# Altium project PB-RESPIRADOR-01.PrjPcb
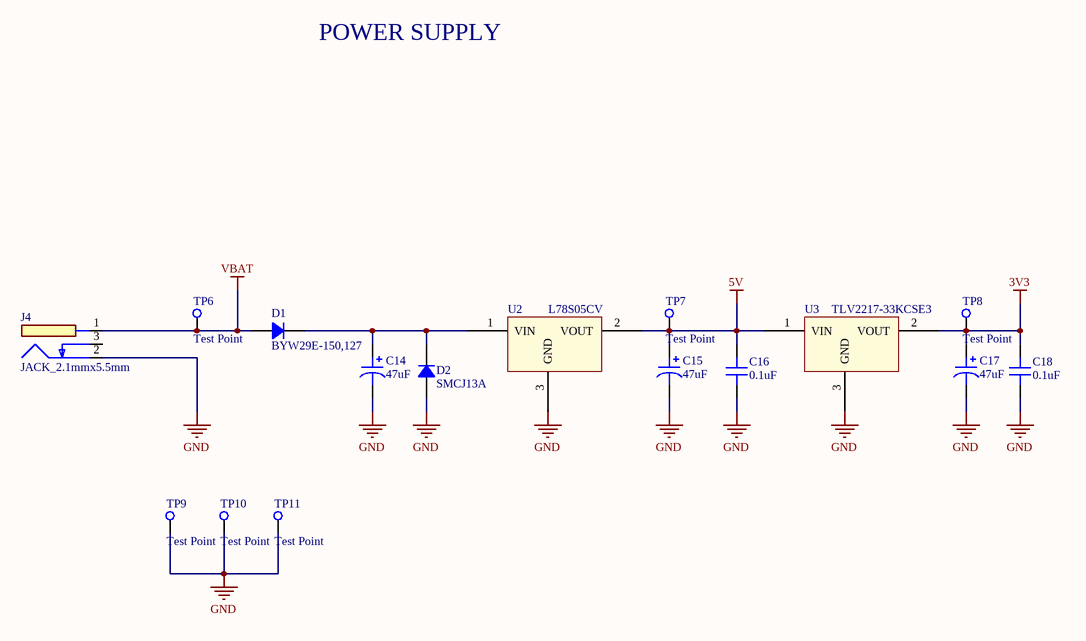
[diagram p0: POWER.SchDoc]
5 sheets, 133 parts. Net scope: hierarchical (ports join the sheet entries above them; power ports are global).
Sheets:
  POWER.SchDoc
  MAIN.SchDoc
    MCU = MCU.SchDoc
    SWITCHING = SWITCHING.SchDoc
    SENSORS = SENSORS.SchDoc

## Sheet POWER.SchDoc
size A4

### Parts
C14  47uF  [CAP_POL_D6.3MM_L5.8MM_H6.6MM]
C15  47uF  [CAP_POL_D6.3MM_L5.8MM_H6.6MM]
C16  0.1uF  [C_0805]
C17  47uF  [CAP_POL_D6.3MM_L5.8MM_H6.6MM]
C18  0.1uF  [C_0805]
D1  BYW29E-150,127  [TO-220-2]
D2  SMCJ13A  [DO-214AB-2]
J4  JACK_2.1mmx5.5mm  [JACK_2.1mmx5.5mm]
TP6  Test Point  [Test_Point]
TP7  Test Point  [Test_Point]
TP8  Test Point  [Test_Point]
TP9  Test Point  [Test_Point]
TP10  Test Point  [Test_Point]
TP11  Test Point  [Test_Point]
U2  L78S05CV  [TO-220]
U3  TLV2217-33KCSE3  [TO-220]

### Nets
3V3: C17.1 C18.2 TP8.1(TP) U3.2(VOUT)  [project net LM9402VDD]
5V: C15.1 C16.2 TP7.1(TP) U2.2(VOUT) U3.1(VIN)
GND: C14.2 C15.2 C16.1 C17.2 C18.1 D2.1 J4.2 TP9.1(TP) TP10.1(TP) TP11.1(TP) U2.3(GND) U3.3(GND)
VBAT: D1.1 J4.1 TP6.1(TP)
NetC14_1: C14.1 D1.2 D2.2 U2.1(VIN)

Not connected (* = marked no-connect by the designer): J4 3

### Notes on the sheet
- POWER SUPPLY

### Library data of the parts
C14 C15 C17 = C_POL_UWT1V470MCL1GS: CAP 47UF 35V ELECT WT SMD D6.3MM L5.8MM H 6.6MM; Part Number: UWT1V470MCL1GS; Datasheet: https://br.mouser.com/datasheet/2/293/e-wt-30307.pdf; Supplier: https://br.mouser.com/ProductDetail/Nichicon/UWT1V470MCL1GS?qs=ljCeji4nMDl8Y30ehuNAUQ%3D%3D; Value: 47uF; Voltage: 35V
C16 C18 = C_0805_GRM21BR71H104KA01L: CAP CER .1UF 50V 10% X7R 080; Part Number: GRM21BR71H104KA01L; Datasheet: https://br.mouser.com/datasheet/2/281/murata_03052018_GRM_Series_1-1310166.pdf; Supplier: https://br.mouser.com/ProductDetail/Murata-Electronics/GRM21BR71H104KA01L?qs=JovLnzPPZAL81o2XNDa%2FDA%3D%3D; Value: 0.1uF; Voltage: 50V
D1 = DIODE_BYW29E-150,127: DIODE RECT UFAST 150V TO220AC SOD59; Part Number: BYW29E-150,127; Supplier: https://br.mouser.com/ProductDetail/WeEn-Semiconductors/BYW29E-150127?qs=me8TqzrmIYVz9CWyXJlNFA%3D%3D; Datasheet: https://br.mouser.com/datasheet/2/848/byw29e-150-1520821.pdf; Voltage: 150V; Power: *
D2 = DIODE_SMCJ13A: DIODE TVS 13V 1500W UNI 5% SMC DO-214AB-2_; Voltage: 150V; Part Number: SMCJ13A; Supplier: https://br.mouser.com/ProductDetail/Littelfuse/SMCJ13A?qs=JJML70Qc14udM04Txwcydg%3D%3D; Datasheet: https://br.mouser.com/datasheet/2/848/byw29e-150-1520821.pdf; Power: 1500W
J4 = JACK_2.1mmx5.5mm: Jack/Connector 2.1mm x 5.5mm; Part Number: CON-SOCJ-2155; Manufacturer: Gravitech; Datasheet: http://www.gravitech.us/poja2x51.html; Supplier: https://br.mouser.com/ProductDetail/Gravitech/CON-SOCJ-2155?qs=sGAEpiMZZMvtrnhC60i%252BOueHg%2FyK0jmoLPszqcLww24%3D
U2 = REGULATOR_L78S05CV: IC REG POSITIVE 2A 5V TO-220; Part Number: L78S05CV; Datasheet: https://br.mouser.com/datasheet/2/389/l78s-974158.pdf; Supplier: https://br.mouser.com/ProductDetail/STMicroelectronics/L78S05CV-DG?qs=UOUhb9503hFQHy635AeyYA%3D%3D
U3 = REGULATOR_TLV2217: IC LDO REG FXDVOLT 3.3V TO-220; Part Number: TLV2217-33KCSE3; Datasheet: http://www.ti.com/general/docs/suppproductinfo.tsp?distId=26&gotoUrl=http%3A%2F%2Fwww.ti.com%2Flit%2Fgpn%2Ftlv2217; Supplier: https://br.mouser.com/ProductDetail/Texas-Instruments/TLV2217-33KCSE3?qs=LVErsypW30y56XyeRJBjlA%3D%3D

## Sheet MAIN.SchDoc
size A4
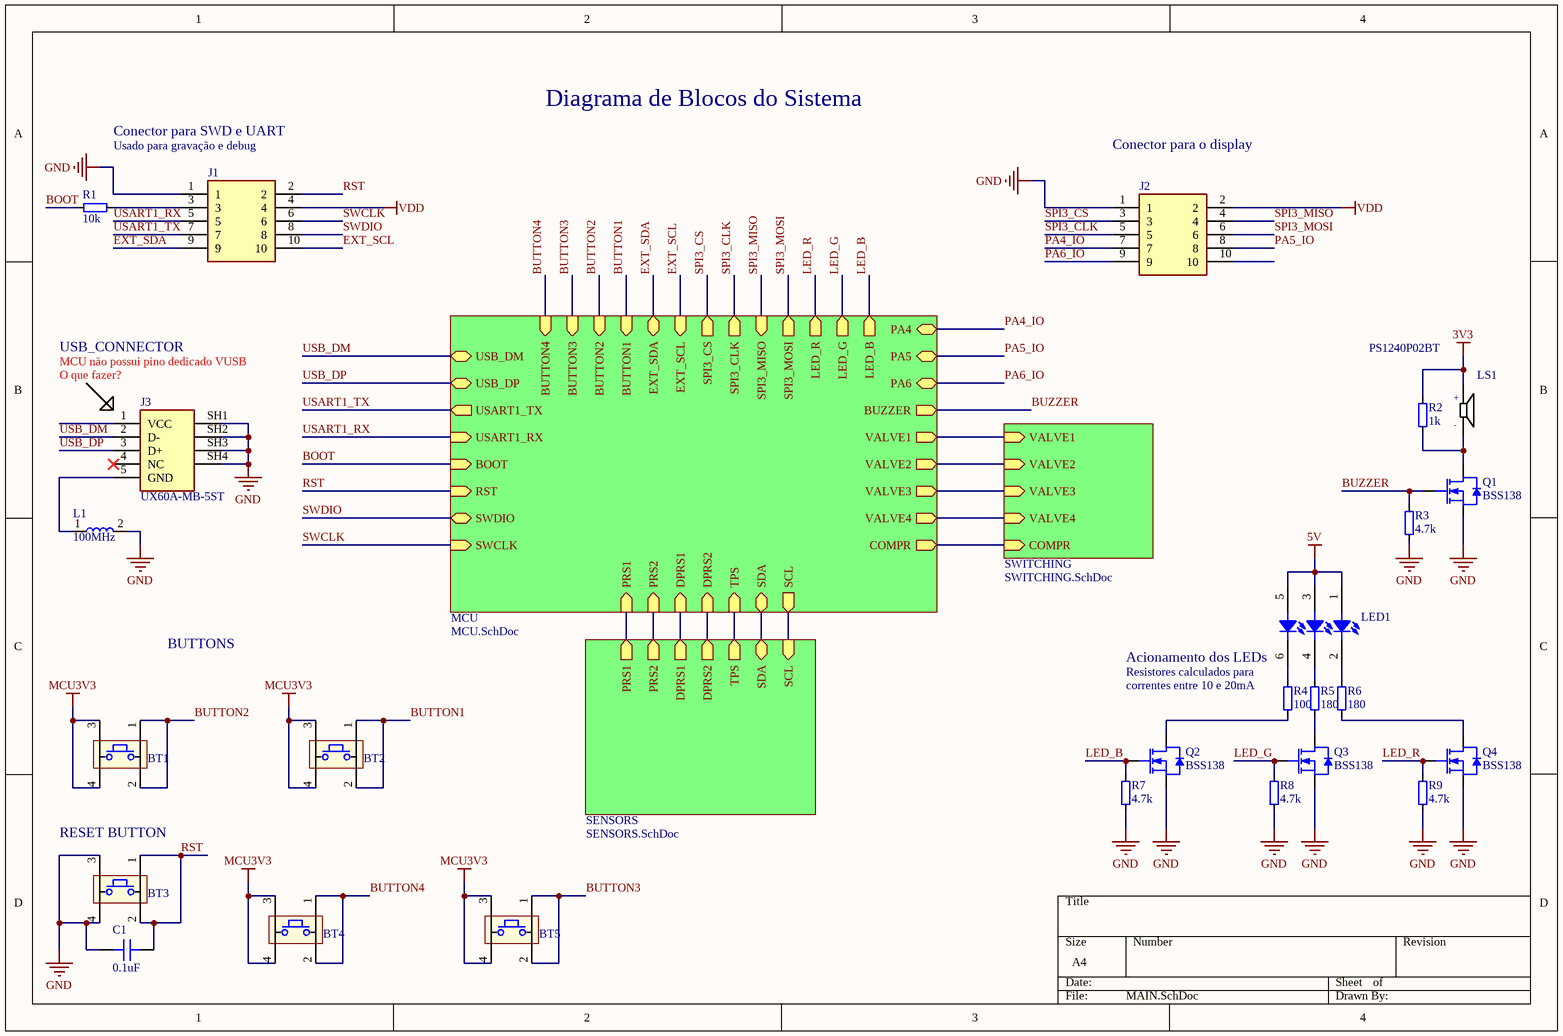
[diagram p1: MAIN.SchDoc]

### Parts
BT1  PTS645SH50SMTR92LFS  [BUTTON_TACTILE_6x6mm]  (value not drawn)
BT2  PTS645SH50SMTR92LFS  [BUTTON_TACTILE_6x6mm]  (value not drawn)
BT3  PTS645SH50SMTR92LFS  [BUTTON_TACTILE_6x6mm]  (value not drawn)
BT4  PTS645SH50SMTR92LFS  [BUTTON_TACTILE_6x6mm]  (value not drawn)
BT5  PTS645SH50SMTR92LFS  [BUTTON_TACTILE_6x6mm]  (value not drawn)
C1  0.1uF  [C_0805]
J1  HEADER_5X2_2.54mm  [HEADER_5X2_2.54mm]  (value not drawn)
J2  HEADER_5X2_2.54mm  [HEADER_5X2_2.54mm]  (value not drawn)
J3  UX60A-MB-5ST  [USB_CONN_SMT]
L1  100MHz  [L_0603]
LED1  ASMB-UTF0-0D20B  [LED_ASMB-UTF0-0D20B]  (value not drawn)
LS1  PS1240P02BT  [BUZZER_THT]
Q1  BSS138  [SOT-23]
Q2  BSS138  [SOT-23]
Q3  BSS138  [SOT-23]
Q4  BSS138  [SOT-23]
R1  10k  [R_0805]
R2  1k  [R_0805]
R3  4.7k  [R_0805]
R4  100  [R_0805]
R5  180  [R_0805]
R6  180  [R_0805]
R7  4.7k  [R_0805]
R8  4.7k  [R_0805]
R9  4.7k  [R_0805]

### Sub-sheets
MCU = MCU.SchDoc: VALVE1 (out), VALVE2 (out), VALVE3 (out), VALVE4 (out), COMPR (out), PRS1 (in), PRS2 (in), DPRS1 (in), DPRS2 (in), TPS (in), SDA (bidir), SCL (out), USART1_RX (in), BOOT (in), RST (in), SWDIO (bidir), SWCLK (in), USART1_TX (out), EXT_SDA (bidir), EXT_SCL (in), SPI3_CS (out), SPI3_CLK (out), SPI3_MISO (in), SPI3_MOSI (out), LED_R (out), LED_G (out), LED_B (out), BUZZER (out), BUTTON1 (in), BUTTON2 (in), BUTTON3 (in), BUTTON4 (in), USB_DP (bidir), USB_DM (bidir), PA5, PA6, PA4
SENSORS = SENSORS.SchDoc: PRS1 (out), PRS2 (out), DPRS1 (out), DPRS2 (out), SDA (bidir), TPS (out), SCL (in)
SWITCHING = SWITCHING.SchDoc: VALVE1 (in), VALVE2 (in), VALVE3 (in), VALVE4 (in), COMPR (in)

### Nets
3V3: LS1.1 R2.2  [project net LM9402VDD]
5V: LED1.1(RA) LED1.3(GA) LED1.5(BA)
GND: BT3.3 BT3.4 C1.1 J1.1 J2.1 J3.SH1 J3.SH2 J3.SH3 J3.SH4 L1.2 Q1.2(S) Q2.2(S) Q3.2(S) Q4.2(S) R3.1 R7.1 R8.1 R9.1
MCU3V3: BT1.3 BT1.4 BT2.3 BT2.4 BT4.3 BT4.4 BT5.3 BT5.4 J1.4 J2.2  [also labelled VDD]
BOOT: R1.2 ; sheet MCU/BOOT
BUTTON1: BT2.1 BT2.2 ; sheet MCU/BUTTON1
BUTTON2: BT1.1 BT1.2 ; sheet MCU/BUTTON2
BUTTON3: BT5.1 BT5.2 ; sheet MCU/BUTTON3
BUTTON4: BT4.1 BT4.2 ; sheet MCU/BUTTON4
BUZZER: Q1.1(G) R3.2 ; sheet MCU/BUZZER
EXT_SCL: J1.10 ; sheet MCU/EXT_SCL
EXT_SDA: J1.9 ; sheet MCU/EXT_SDA
LED_B: Q2.1(G) R7.2 ; sheet MCU/LED_B
LED_G: Q3.1(G) R8.2 ; sheet MCU/LED_G
LED_R: Q4.1(G) R9.2 ; sheet MCU/LED_R
PA4_IO: J2.7 ; sheet MCU/PA4
PA5_IO: J2.8 ; sheet MCU/PA5
PA6_IO: J2.9 ; sheet MCU/PA6
RST: BT3.1 BT3.2 C1.2 J1.2 ; sheet MCU/RST
SPI3_CLK: J2.5 ; sheet MCU/SPI3_CLK
SPI3_CS: J2.3 ; sheet MCU/SPI3_CS
SPI3_MISO: J2.4 ; sheet MCU/SPI3_MISO
SPI3_MOSI: J2.6 ; sheet MCU/SPI3_MOSI
SWCLK: J1.6 ; sheet MCU/SWCLK
SWDIO: J1.8 ; sheet MCU/SWDIO
USART1_RX: J1.5 ; sheet MCU/USART1_RX
USART1_TX: J1.7 ; sheet MCU/USART1_TX
USB_DM: J3.2(D-) ; sheet MCU/USB_DM
USB_DP: J3.3(D+) ; sheet MCU/USB_DP
NetC20_2: sheet MCU/PRS1, sheet SENSORS/PRS1
NetC25_2: sheet MCU/DPRS1, sheet SENSORS/DPRS1
NetC26_2: sheet MCU/PRS2, sheet SENSORS/PRS2
NetC31_2: sheet MCU/DPRS2, sheet SENSORS/DPRS2
NetJ1_3: J1.3 R1.1
NetJ3_5: J3.5(GND) L1.1
NetLED1_2: LED1.2(RC) R6.2
NetLED1_4: LED1.4(GC) R5.2
NetLED1_6: LED1.6(BC) R4.2
NetLS1_2: LS1.2 Q1.3(D) R2.1
NetQ2_3: Q2.3(D) R4.1
NetQ3_3: Q3.3(D) R5.1
NetQ4_3: Q4.3(D) R6.1
NetR12_1: sheet MCU/SDA, sheet SENSORS/SDA
NetR13_1: sheet MCU/SCL, sheet SENSORS/SCL
NetR18_1: sheet MCU/COMPR, sheet SWITCHING/COMPR
NetR21_1: sheet MCU/VALVE1, sheet SWITCHING/VALVE1
NetR22_1: sheet MCU/VALVE2, sheet SWITCHING/VALVE2
NetR25_1: sheet MCU/VALVE3, sheet SWITCHING/VALVE3
NetR26_1: sheet MCU/VALVE4, sheet SWITCHING/VALVE4
NetTP12_1: sheet MCU/TPS, sheet SENSORS/TPS

Not connected (* = marked no-connect by the designer): J2 10; J3 1(VCC) 4(NC)*

### Notes on the sheet
- Diagrama de Blocos do Sistema
- Conector para SWD e UART
- Usado para gravação e debug
- Conector para o display
- USB_CONNECTOR
- MCU não possui pino dedicado VUSB
- (near J3) O que fazer?
- BUTTONS
- Acionamento dos LEDs
- (near R4) Resistores calculados para
- (near R4) correntes entre 10 e 20mA
- (near BT3) RESET BUTTON
- (in symbol BUZZER_PS1240P02BT) +; -

### Library data of the parts
BT1-BT5 = BUTTON_TACTICAL: Tactile Switches SWITCH TACTILE; Part Number: PTS645SH50SMTR92LFS; Datasheet: https://www.mouser.in/datasheet/2/60/pts645-1382776.pdf; Supplier: https://www.mouser.in/ProductDetail/CK/PTS645SH50SMTR92LFS?qs=FESYatJ8odJq4YGoPOs%2Fjw==
C1 = C_0805_C0805C104K5RAC7411: SMD/SMT 50V 0.1uF X7R 0805 10% Ceramic; Manufacturer: KEMET; Value: 0.1uF; Voltage: 50V; Datasheet: https://www.mouser.in/datasheet/2/212/KEM_C1002_X7R_SMD-1102033.pdf; Supplier: https://www.mouser.in/ProductDetail/KEMET/C0805C104K5RAC7411?qs=sGAEpiMZZMukHu%252BjC5l7YUy%2FB4dg%2FhTABr7B0xlsxU8%3D; Temperature: -55 to +125ºC; Part Number: C0805C104K5RAC7411
J1 J2 = HEADER_5X2_2.54mm: Headers & Wire Housings 10 POSITION DBL. ROW; Part Number: 67997-410HLF; Datasheet: https://www.amphenol-icc.com/media/wysiwyg/files/documentation/datasheet/boardwiretoboard/bwb_bergstik.pdf; Supplier: https://www.mouser.in/ProductDetail/Amphenol-FCI/67997-410HLF?qs=sGAEpiMZZMsMLZWdhVL71zU2Dhk42U5G
J3 = USB_CONN_UX60A-MB-5ST: USB Connector UX60A-MB-5ST; Height: 4mm; Datasheet: https://media.digikey.com/pdf/Data%20Sheets/Hirose%20PDFs/UX%20Series.pdf; Supplier: https://www.mouser.in/ProductDetail/Hirose-Connector/UX60A-MB-5ST?qs=XQjbzJWzFPVU%252BTtGLEiQTQ==; Part Number: UX60A-MB-5ST
L1 = L_0603_BKP1608HS271-T: FERRITE BEAD 270 OHM 0603; Value: 100MHz; Datasheet: https://www.mouser.in/datasheet/2/396/mlci08_e-1396622.pdf; Supplier: https://www.mouser.in/ProductDetail/Taiyo-Yuden/BKP1608HS271-T?qs=I6KAKw0tg2zbDi4vUs5b8A==
LED1 = LED_ASMB-UTF0-0D20B: SMD 2828 Tricolor PLCC6 LEDs; Forward Voltage: 2.1V; Forward Current: 25mA; Datasheet: https://docs.broadcom.com/doc/ASMB-UTF0-0D20B-DS100; Supplier: https://www.mouser.in/ProductDetail/Broadcom/ASMB-UTF0-0D20B?qs=sGAEpiMZZMtilyJihmhKq2AQS22fZSBSgD7nbSPNdwMclln52G2Icg%3D%3D; Part Number: ASMB-UTF0-0D20B
LS1 = BUZZER_PS1240P02BT: Piezo Buzzer Round 12.2mmx6.5mm 4kHz Vin=3V; Value: 4kHz; Part Number: PS1240P02BT; Datasheet: https://br.mouser.com/datasheet/2/400/iezoelectronic_buzzer_ps_en-1131915.pdf; Supplier: https://br.mouser.com/ProductDetail/TDK/PS1240P02BT?qs=sGAEpiMZZMsK322k1rNFfYfXmCWsjkB8iQfg2vl062k%3D
Q1-Q4 = BSS138: MOSFET SOT-23 N-CH LOGIC; Part Number: BSS138; Datasheet: https://br.mouser.com/datasheet/2/308/BSS138-D-1658842.pdf; Supplier: https://br.mouser.com/ProductDetail/ON-Semiconductor-Fairchild/BSS138?qs=sGAEpiMZZMshyDBzk1%2FWi1qxDdW%2FXBi2IwQV99jpxW8%3D
R1 = R_0805_ERJ-6GEYJ103V: RES 10K OHM 1/8W 5% 0805 SMD; Manufacturer: Panasonic - ECG; Voltage: 150V; Value: 10k; Supplier: https://www.mouser.in/ProductDetail/Panasonic/ERJ-6GEYJ103V?qs=tQNqqtTOejK5rw%252BRxJVxUA==; Datasheet: https://www.mouser.in/datasheet/2/315/AOA0000C301-1488782.pdf; Temperature: -55 to +155ºC; Part Number: ERJ-6GEYJ103V
R2 = R_0805_ERJ-6GEYJ102V: SMD 0805 1K OHM 5% AEC-Q200; Manufacturer: Panasonic - ECG; Value: 1k; Supplier: https://br.mouser.com/ProductDetail/Panasonic/ERJ-6GEYJ102V?qs=%2Fha2pyFaduiXHwl36i8QX1Is8RUpW4zS7XPMZn%2FLDmVYYw7P67RQlQ%3D%3D; Datasheet: https://br.mouser.com/datasheet/2/315/AOA0000C301-1488782.pdf; Temperature: -55 to +155ºC; Part Number: ERJ-6GEYJ102V
R3 R7-R9 = R_0805_ERJ-6GEYJ472V: SMD 0805 4.7K OHM 5% AEC-Q200 Thick Film; Manufacturer: Panasonic; Voltage: 150V; Value: 4.7k; Supplier: https://www.mouser.in/ProductDetail/Panasonic/ERJ-6GEYJ472V?qs=tQNqqtTOejJz%2FGQTI2SwEA==; Datasheet: https://www.mouser.in/datasheet/2/315/AOA0000C301-1488782.pdf; Temperature: -55 to +155ºC; Part Number: ERJ-6GEYJ472V
R4 = R_0805_ERJ-6GEYJ101V: SMD 0805 100 OHM 5% AEC-Q200 1/8 W; Manufacturer: Panasonic - ECG; Value: 100; Supplier: https://www.mouser.in/ProductDetail/Panasonic/ERJ-6GEYJ101V?qs=%2Fha2pyFaduiXHwl36i8QX1f35tjxZRQaem8SvM77FOq%252B6pZFta5%2F9g%3D%3D; Datasheet: https://www.mouser.in/datasheet/2/315/AOA0000C301-1488782.pdf; Temperature: -55 to +155ºC; Part Number: ERJ-6GEYJ101V
R5 R6 = R_0805_ERJ-6GEYJ181V: RES 180 OHM 1/8W 1% 0805 SMD; Manufacturer: Panasonic - ECG; Value: 180; Supplier: https://br.mouser.com/ProductDetail/Panasonic/ERJ-6GEYJ181V?qs=8%252BG0TiN%2FgVrt6v%2F%2FVOHUqg%3D%3D; Datasheet: https://br.mouser.com/datasheet/2/315/AOA0000C301-1488782.pdf; Temperature: -55 to +155ºC; Part Number: ERJ-6GEYJ181V

## Sheet MCU.SchDoc
size A4
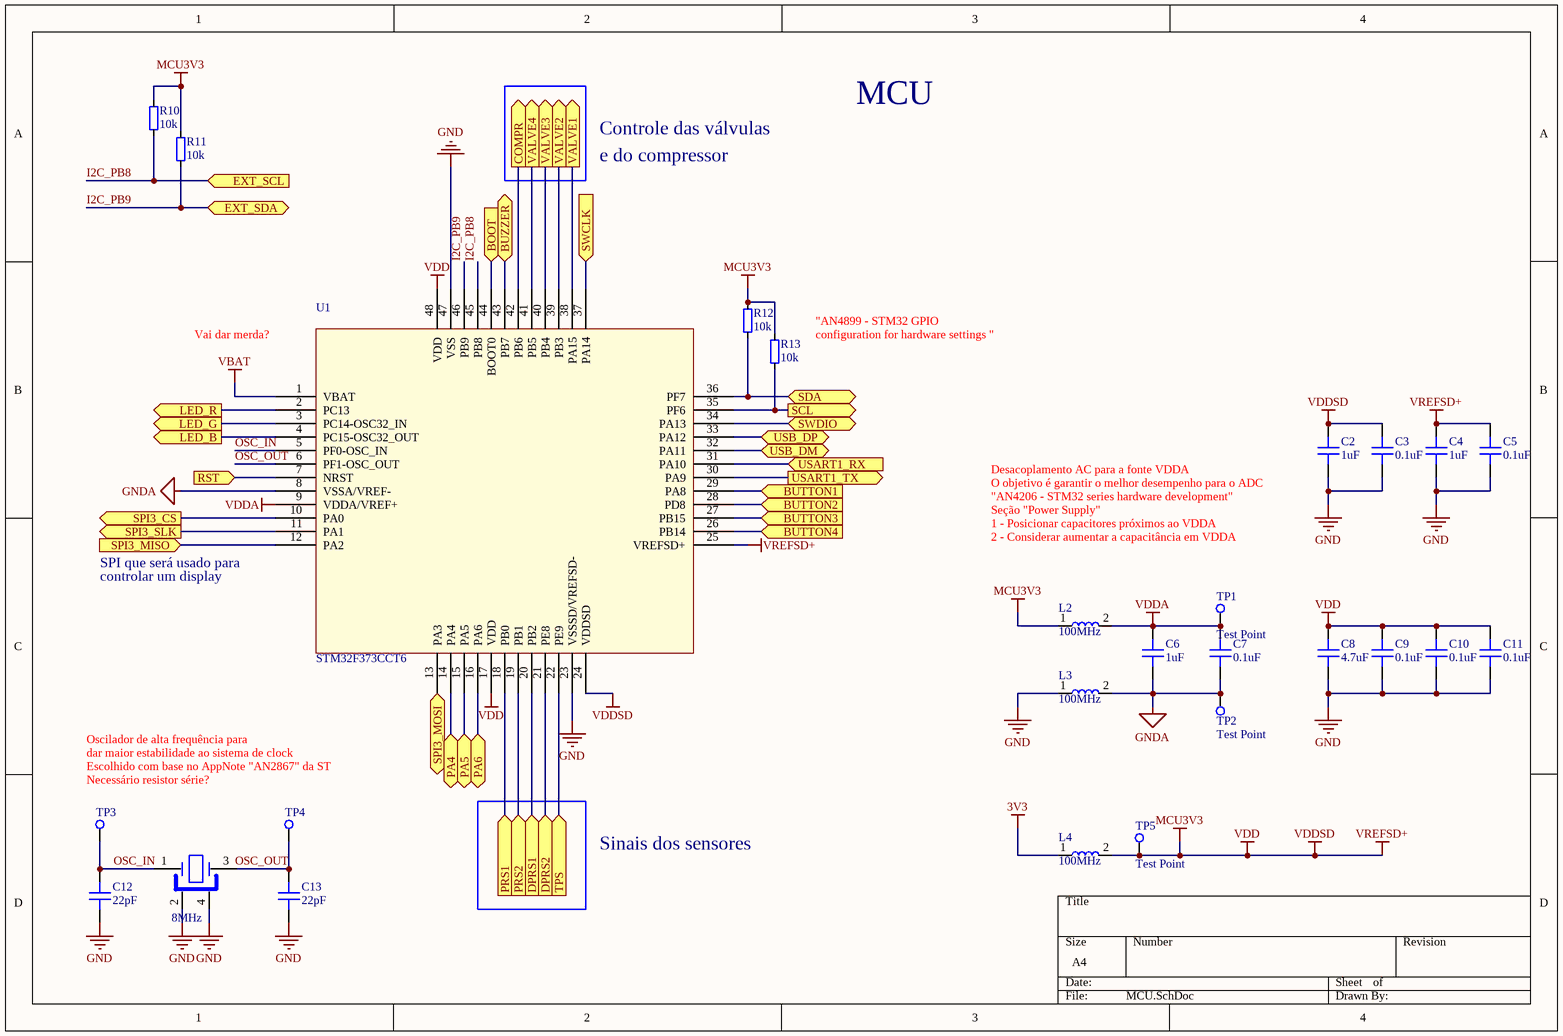
[diagram p2: MCU.SchDoc]

### Parts
C2  1uF  [C_0805]
C3  0.1uF  [C_0805]
C4  1uF  [C_0805]
C5  0.1uF  [C_0805]
C6  1uF  [C_0805]
C7  0.1uF  [C_0805]
C8  4.7uF  [C_0805]
C9  0.1uF  [C_0805]
C10  0.1uF  [C_0805]
C11  0.1uF  [C_0805]
C12  22pF  [C_0603]
C13  22pF  [C_0603]
L2  100MHz  [L_0603]
L3  100MHz  [L_0603]
L4  100MHz  [L_0603]
R10  10k  [R_0805]
R11  10k  [R_0805]
R12  10k  [R_0805]
R13  10k  [R_0805]
TP1  Test Point  [Test_Point]
TP2  Test Point  [Test_Point]
TP3  Test Point  [Test_Point]  (value not drawn)
TP4  Test Point  [Test_Point]  (value not drawn)
TP5  Test Point  [Test_Point]
U1  STM32F373CCT6  [MCU_STM32F373CC7]
XTAL1  8MHz  [XTAL_8MHZ]

### Ports
BOOT (in), BUTTON1 (in), BUTTON2 (in), BUTTON3 (in), BUTTON4 (in), BUZZER, COMPR (out), DPRS1 (in), DPRS2 (in), EXT_SCL (in), EXT_SDA (bidir), LED_B (out), LED_G (out), LED_R (out), PA4 (bidir), PA5 (bidir), PA6 (bidir), PRS1 (in), PRS2 (in), RST (in), SCL (out), SDA (bidir), SPI3_CS (out), SPI3_MISO (in), SPI3_MOSI (out), SPI3_SLK (out), SWCLK (in), SWDIO (bidir), TPS (in), USART1_RX (in), USART1_TX (out), USB_DM, USB_DP, VALVE1 (out), VALVE2 (out), VALVE3 (out), VALVE4 (out)

### Nets
3V3: L4.1  [project net LM9402VDD]
GND: C2.1 C3.2 C4.1 C5.2 C8.2 C9.2 C10.2 C11.2 C12.1 C13.1 L3.1 U1.23(VSSSD/VREFSD-) U1.47(VSS) XTAL1.2 XTAL1.4
GNDA: C6.1 C7.1 L3.2 TP2.1(TP) U1.8(VSSA/VREF-)
MCU3V3: C2.2 C3.1 C4.2 C5.1 C8.1 C9.1 C10.1 C11.1 L2.1 L4.2 R10.2 R11.2 R12.2 R13.2 TP5.1(TP) U1.17(VDD) U1.24(VDDSD) U1.25(VREFSD+) U1.48(VDD)  [also labelled VDD, VDDSD, VREFSD+]
VBAT: U1.1(VBAT)
VDDA: C6.2 C7.2 L2.2 TP1.1(TP) U1.9(VDDA/VREF+)
BOOT: U1.44(BOOT0) ; port BOOT
BUTTON1: U1.29(PA8) ; port BUTTON1
BUTTON2: U1.28(PD8) ; port BUTTON2
BUTTON3: U1.27(PB15) ; port BUTTON3
BUTTON4: U1.26(PB14) ; port BUTTON4
BUZZER: U1.43(PB7) ; port BUZZER
I2C_PB8: R10.1 U1.45(PB8) ; port EXT_SCL  [project net EXT_SCL]
I2C_PB9: R11.1 U1.46(PB9) ; port EXT_SDA  [project net EXT_SDA]
LED_B: U1.4(PC15-OSC32_OUT) ; port LED_B
LED_G: U1.3(PC14-OSC32_IN) ; port LED_G
LED_R: U1.2(PC13) ; port LED_R
OSC_IN: C12.2 TP3.1(TP) U1.5(PF0-OSC_IN) XTAL1.1
OSC_OUT: U1.6(PF1-OSC_OUT)
PA4_IO: U1.14(PA4) ; port PA4
PA5_IO: U1.15(PA5) ; port PA5
PA6_IO: U1.16(PA6) ; port PA6
RST: U1.7(NRST) ; port RST
SPI3_CS: U1.10(PA0) ; port SPI3_CS
SPI3_MISO: U1.12(PA2) ; port SPI3_MISO
SPI3_MOSI: U1.13(PA3) ; port SPI3_MOSI
SWCLK: U1.37(PA14) ; port SWCLK
SWDIO: U1.34(PA13) ; port SWDIO
USART1_RX: U1.31(PA10) ; port USART1_RX
USART1_TX: U1.30(PA9) ; port USART1_TX
USB_DM: U1.32(PA11) ; port USB_DM
USB_DP: U1.33(PA12) ; port USB_DP
NetC13_2: C13.2 TP4.1(TP) XTAL1.3
NetC20_2: U1.18(PB0) ; port PRS1
NetC25_2: U1.20(PB2) ; port DPRS1
NetC26_2: U1.19(PB1) ; port PRS2
NetC31_2: U1.21(PE8) ; port DPRS2
NetR12_1: R12.1 U1.36(PF7) ; port SDA
NetR13_1: R13.1 U1.35(PF6) ; port SCL
NetR18_1: U1.42(PB6) ; port COMPR
NetR21_1: U1.38(PA15) ; port VALVE1
NetR22_1: U1.39(PB3) ; port VALVE2
NetR25_1: U1.40(PB4) ; port VALVE3
NetR26_1: U1.41(PB5) ; port VALVE4
NetTP12_1: U1.22(PE9) ; port TPS
NetU1_11: U1.11(PA1) ; port SPI3_SLK

### Notes on the sheet
- MCU
- Controle das válvulas
- e do compressor
- (near U1) Vai dar merda?
- (near R13) "AN4899 - STM32 GPIO
- (near R13) configuration for hardware settings "
- Desacoplamento AC para a fonte VDDA
- (near C2) O objetivo é garantir o melhor desempenho para o ADC
- "AN4206 - STM32 series hardware development"
- Seção "Power Supply"
- (near U1) SPI que será usado para
- controlar um display
- 1 - Posicionar capacitores próximos ao VDDA
- 2 - Considerar aumentar a capacitância em VDDA
- Oscilador de alta frequência para
- Escolhido com base no AppNote "AN2867" da ST
- dar maior estabilidade ao sistema de clock
- Necessário resistor série?
- Sinais dos sensores
- Labels drawn without touching a wire or pin: OSC_OUT

### Library data of the parts
C2 C4 C6 = C_0805_UMF212B7105KGHT: SMD/SMT 0805 50V 1uF 10% AEC-Q200 Ceramic; Manufacturer: Taiyo Yuden; Value: 1uF; Voltage: 50V; Datasheet: https://www.mouser.in/datasheet/2/396/taiyo_yuden_07182019_MLCC_AECQ200_Grade_1_X7R_data-1622917.pdf; Supplier: https://www.mouser.in/ProductDetail/Taiyo-Yuden/UMF212B7105KGHT?qs=sGAEpiMZZMukHu%252BjC5l7YbZJogKwR3uAsvk8LFV85oI%3D; Temperature: -55 to 125ºC; Part Number: UMF212B7105KGHT
C3 C5 C7 C9-C11 = C_0805_C0805C104K5RAC7411: as C1 on sheet MAIN; Value: 0.1uF; Voltage: 50V; Datasheet: https://www.mouser.in/datasheet/2/212/KEM_C1002_X7R_SMD-1102033.pdf; Supplier: https://www.mouser.in/ProductDetail/KEMET/C0805C104K5RAC7411?qs=sGAEpiMZZMukHu%252BjC5l7YUy%2FB4dg%2FhTABr7B0xlsxU8%3D; Temperature: -55 to +125ºC; Part Number: C0805C104K5RAC7411
C8 = C_0805_C2012X7R1H475K125AC: SMD/SMT 0805 50VDC 4.7uF 10% X7R CERAMIC; Manufacturer: TDK; Voltage: 50V; Value: 4.7uF; Datasheet: https://www.mouser.in/datasheet/2/400/lcc_commercial_general_en-837201.pdf; Supplier: https://www.mouser.in/ProductDetail/TDK/C2012X7R1H475K125AC?qs=sGAEpiMZZMukHu%252BjC5l7YTxxtVIkCgfDBgHpaxQ5Dmw%3D; Temperature: -55 to 125ºC; Part Number: C2012X7R1H475K125AC
C12 C13 = C_0603_C0603C220J5GACTU: SMD/SMT 50V 22pF 0603 C0G 5%; Manufacturer: KEMET; Value: 22pF; Voltage: 50V; Datasheet: https://www.mouser.in/datasheet/2/212/KEM_C1003_C0G_SMD-1101588.pdf; Supplier: https://www.mouser.in/ProductDetail/?qs=SdEwkH2X7htVYoqIlDdZ9g%3D%3D; Temperature: -55 to +125ºC; Part Number: C0603C220J5GACTU
L2-L4 = L_0603_BKP1608HS271-T: FERRITE BEAD 270 OHM 0603; Value: 100MHz; Datasheet: https://www.mouser.in/datasheet/2/396/mlci08_e-1396622.pdf; Supplier: https://www.mouser.in/ProductDetail/Taiyo-Yuden/BKP1608HS271-T?qs=I6KAKw0tg2zbDi4vUs5b8A==
R10-R13 = R_0805_ERJ-6GEYJ103V: as R1 on sheet MAIN; Value: 10k; Supplier: https://www.mouser.in/ProductDetail/Panasonic/ERJ-6GEYJ103V?qs=tQNqqtTOejK5rw%252BRxJVxUA==; Datasheet: https://www.mouser.in/datasheet/2/315/AOA0000C301-1488782.pdf; Temperature: -55 to +155ºC; Part Number: ERJ-6GEYJ103V
U1 = MCU_STM32F373CCT6: CORTEX-M4 ST MCU; Part Number: STM32F373CCT6; Datasheet: https://www.mouser.in/datasheet/2/389/dm00046749-1797329.pdf; Supplier: https://www.mouser.in/ProductDetail/STMicroelectronics/STM32F373CCT6?qs=sGAEpiMZZMts0YcPTleK%252BfFyenw%2F%252BoXO
XTAL1 = XTAL_8MHz: ABRACON Crystals 8MHz; Part Number: ABMM2-8.000MHZ-E2-T; Datasheet: https://www.mouser.in/datasheet/2/3/ABMM2-1775066.pdf; Supplier: https://www.mouser.in/ProductDetail/?qs=m%252BUhWDcpCfaGlLHGChx47g%3D%3D; Frequency: 8MHz

## Sheet SWITCHING.SchDoc
size A4
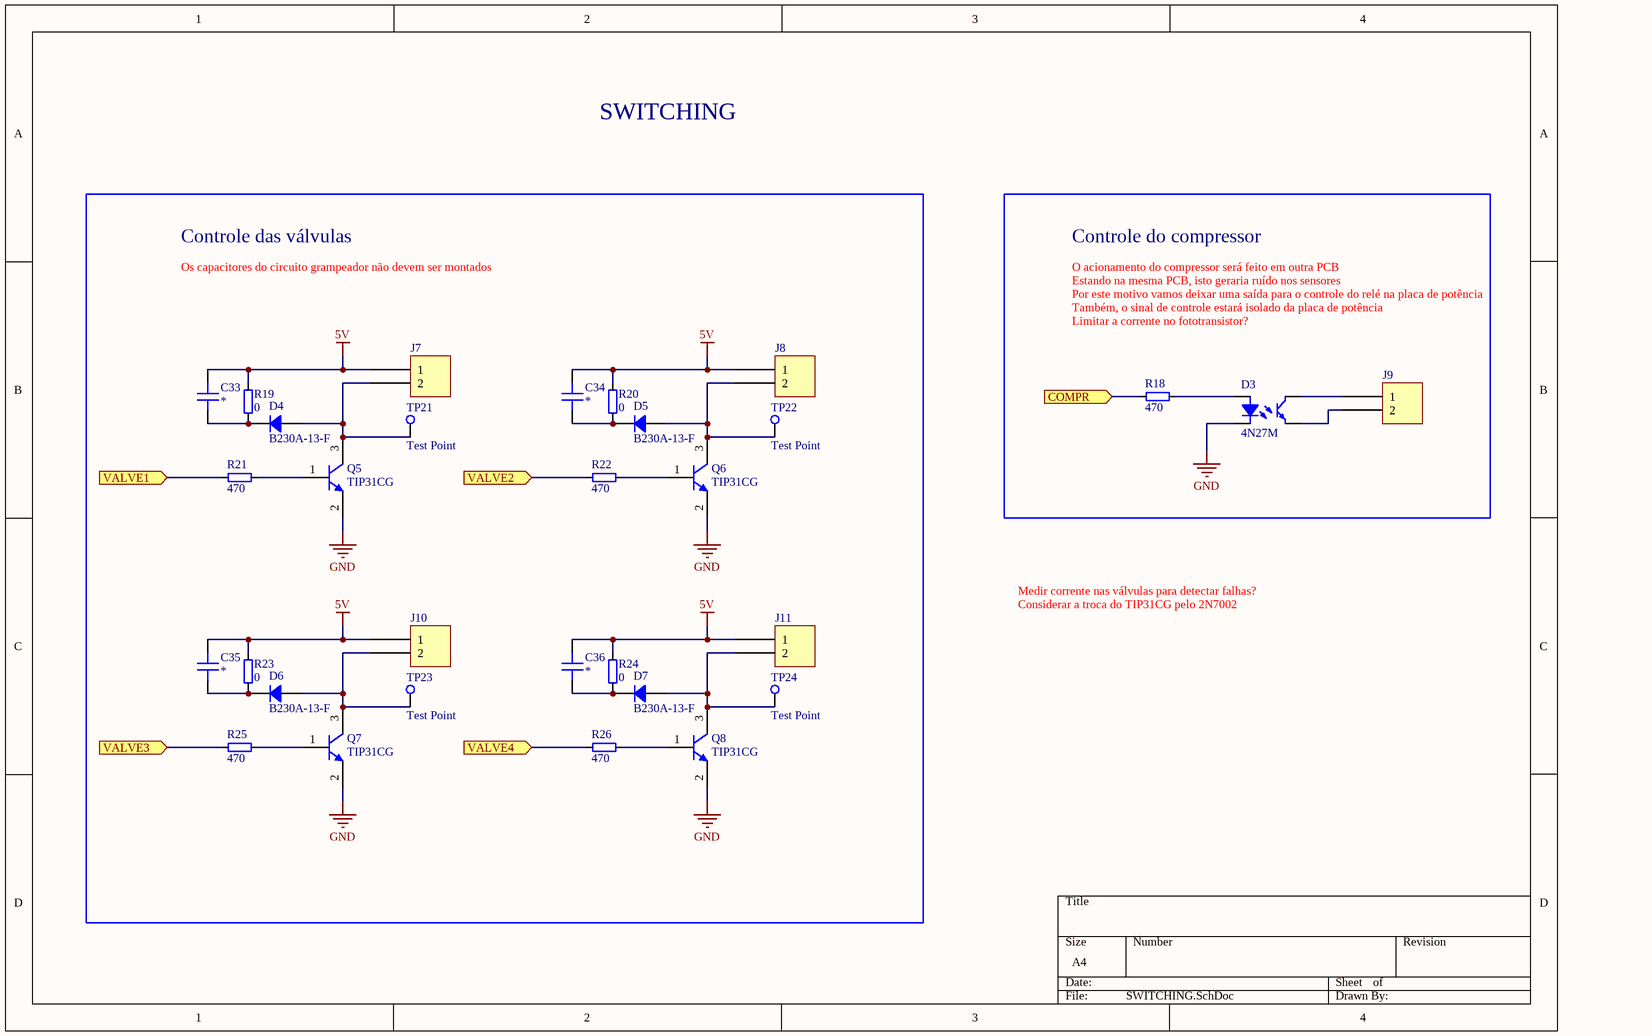
[diagram p3: SWITCHING.SchDoc]

### Parts
C33  *  [C_0805]
C34  *  [C_0805]
C35  *  [C_0805]
C36  *  [C_0805]
D3  4N27M  [DIP6]
D4  B230A-13-F  [DO-214AC]
D5  B230A-13-F  [DO-214AC]
D6  B230A-13-F  [DO-214AC]
D7  B230A-13-F  [DO-214AC]
J7  Term Block 2 Pin 2.54mm  [TERM_BLOCK2PIN]  (value not drawn)
J8  Term Block 2 Pin 2.54mm  [TERM_BLOCK2PIN]  (value not drawn)
J9  Term Block 2 Pin 2.54mm  [TERM_BLOCK2PIN]  (value not drawn)
J10  Term Block 2 Pin 2.54mm  [TERM_BLOCK2PIN]  (value not drawn)
J11  Term Block 2 Pin 2.54mm  [TERM_BLOCK2PIN]  (value not drawn)
Q5  TIP31CG  [TO-220]
Q6  TIP31CG  [TO-220]
Q7  TIP31CG  [TO-220]
Q8  TIP31CG  [TO-220]
R18  470  [R_0805]
R19  0  [R_0805]
R20  0  [R_0805]
R21  470  [R_0805]
R22  470  [R_0805]
R23  0  [R_0805]
R24  0  [R_0805]
R25  470  [R_0805]
R26  470  [R_0805]
TP21  Test Point  [Test_Point]
TP22  Test Point  [Test_Point]
TP23  Test Point  [Test_Point]
TP24  Test Point  [Test_Point]

### Blocks framed on the sheet
Controle das válvulas: C33-C36 D4-D7 J7 J8 J10 J11 Q5-Q8 R19-R26 TP21-TP24
Controle do compressor: D3 J9 R18

### Ports
COMPR (in), VALVE1 (in), VALVE2 (in), VALVE3 (in), VALVE4 (in)

### Nets
5V: C33.2 C34.2 C35.2 C36.2 J7.1 J8.1 J10.1 J11.1 R19.2 R20.2 R23.2 R24.2
GND: D3.2 Q5.2(E) Q6.2(E) Q7.2(E) Q8.2(E)
NetC33_1: C33.1 D4.2 R19.1
NetC34_1: C34.1 D5.2 R20.1
NetC35_1: C35.1 D6.2 R23.1
NetC36_1: C36.1 D7.2 R24.1
NetD3_1: D3.1 R18.2
NetD3_3: D3.3 J9.2
NetD3_4: D3.4 J9.1
NetD4_1: D4.1 J7.2 Q5.3(C) TP21.1(TP)
NetD5_1: D5.1 J8.2 Q6.3(C) TP22.1(TP)
NetD6_1: D6.1 J10.2 Q7.3(C) TP23.1(TP)
NetD7_1: D7.1 J11.2 Q8.3(C) TP24.1(TP)
NetQ5_1: Q5.1(B) R21.2
NetQ6_1: Q6.1(B) R22.2
NetQ7_1: Q7.1(B) R25.2
NetQ8_1: Q8.1(B) R26.2
NetR18_1: R18.1 ; port COMPR
NetR21_1: R21.1 ; port VALVE1
NetR22_1: R22.1 ; port VALVE2
NetR25_1: R25.1 ; port VALVE3
NetR26_1: R26.1 ; port VALVE4

### Notes on the sheet
- SWITCHING
- Os capacitores do circuito grampeador não devem ser montados
- O acionamento do compressor será feito em outra PCB
- Estando na mesma PCB, isto geraria ruído nos sensores
- Por este motivo vamos deixar uma saída para o controle do relé na placa de potência
- Também, o sinal de controle estará isolado da placa de potência
- Limitar a corrente no fototransistor?
- Medir corrente nas válvulas para detectar falhas?
- Considerar a troca do TIP31CG pelo 2N7002

### Library data of the parts
C33-C36 = C_0805: Generic SMD 0805 Capacitor; Value: *; Voltage: *; Datasheet: *; Manufacturer: *; Supplier: *; Temperature: *; Part Number: *
D3 = Optocoupler 4N27M: 4N27M OPTOCOUPLER TRANS-OUT 6-DIP; Part Number: 4N27M; Datasheet: https://br.mouser.com/datasheet/2/239/775704_1-1175530.pdf; Supplier: https://br.mouser.com/ProductDetail/Lite-On/4N27M?qs=gnaPJ2cis710wpcgziU08w%3D%3D
D4-D7 = DIODE_B230A-13-F: DIODE SCHOTTKY 30V 2A SMA; Part Number: B230A-13-F; Supplier: https://br.mouser.com/ProductDetail/Diodes-Incorporated/B230A-13-F?qs=CWr0IvVDl%2FzIzEFfZQUtSw%3D%3D; Datasheet: https://br.mouser.com/datasheet/2/115/ds13004-70120.pdf; Voltage: 30V; Power: *
J7-J11 = TERM BLOCK 2 PIN_1: CONN TERM BLOCK 2.54MM 2POS 125V 6A; Datasheet: https://media.digikey.com/pdf/Data%20Sheets/Phoenix%20Contact%20PDFs/1725656_Ds.pdf; Supplier: https://www.digikey.com/product-detail/en/phoenix-contact/1725656/277-1273-ND/267462
Q5-Q8 = TRANS_TIP31CG: BJT 3A 100V 40W NPN; Part Number: TIP31CG; Datasheet: https://www.onsemi.com/pub/Collateral/TIP31A-D.PDF; Supplier: https://br.mouser.com/ProductDetail/?qs=xZq1yRCsb1d0GJkceBxz7Q%3D%3D
R18 R21 R22 R25 R26 = R_0805_ERJ-6ENF4700V: RES 470 OHM 1/8W 1% 0805 SMD; Manufacturer: Panasonic - ECG; Voltage: 150V; Value: 470; Supplier: https://br.mouser.com/ProductDetail/Panasonic/ERJ-6ENF4700V?qs=haJlXwgIYR1%252BMvNjPRrlhw%3D%3D; Datasheet: https://br.mouser.com/datasheet/2/315/AOA0000C304-1149620.pdf; Temperature: -55 to 155 ºC; Part Number: ERJ-6ENF4700V
R19 R20 R23 R24 = R_0805_ERJ-6GEY0R00V: RES 0 OHM 1/8W 1% 0805 SMD; Manufacturer: Panasonic - ECG; Value: 0; Supplier: https://br.mouser.com/ProductDetail/Panasonic/ERJ-6GEY0R00V?qs=tQNqqtTOejLLHbaWAzeH1w%3D%3D; Datasheet: https://br.mouser.com/datasheet/2/315/AOA0000C301-1488782.pdf; Temperature: -55 to +155ºC; Part Number: ERJ-6GEY0R00V

## Sheet SENSORS.SchDoc
size A4
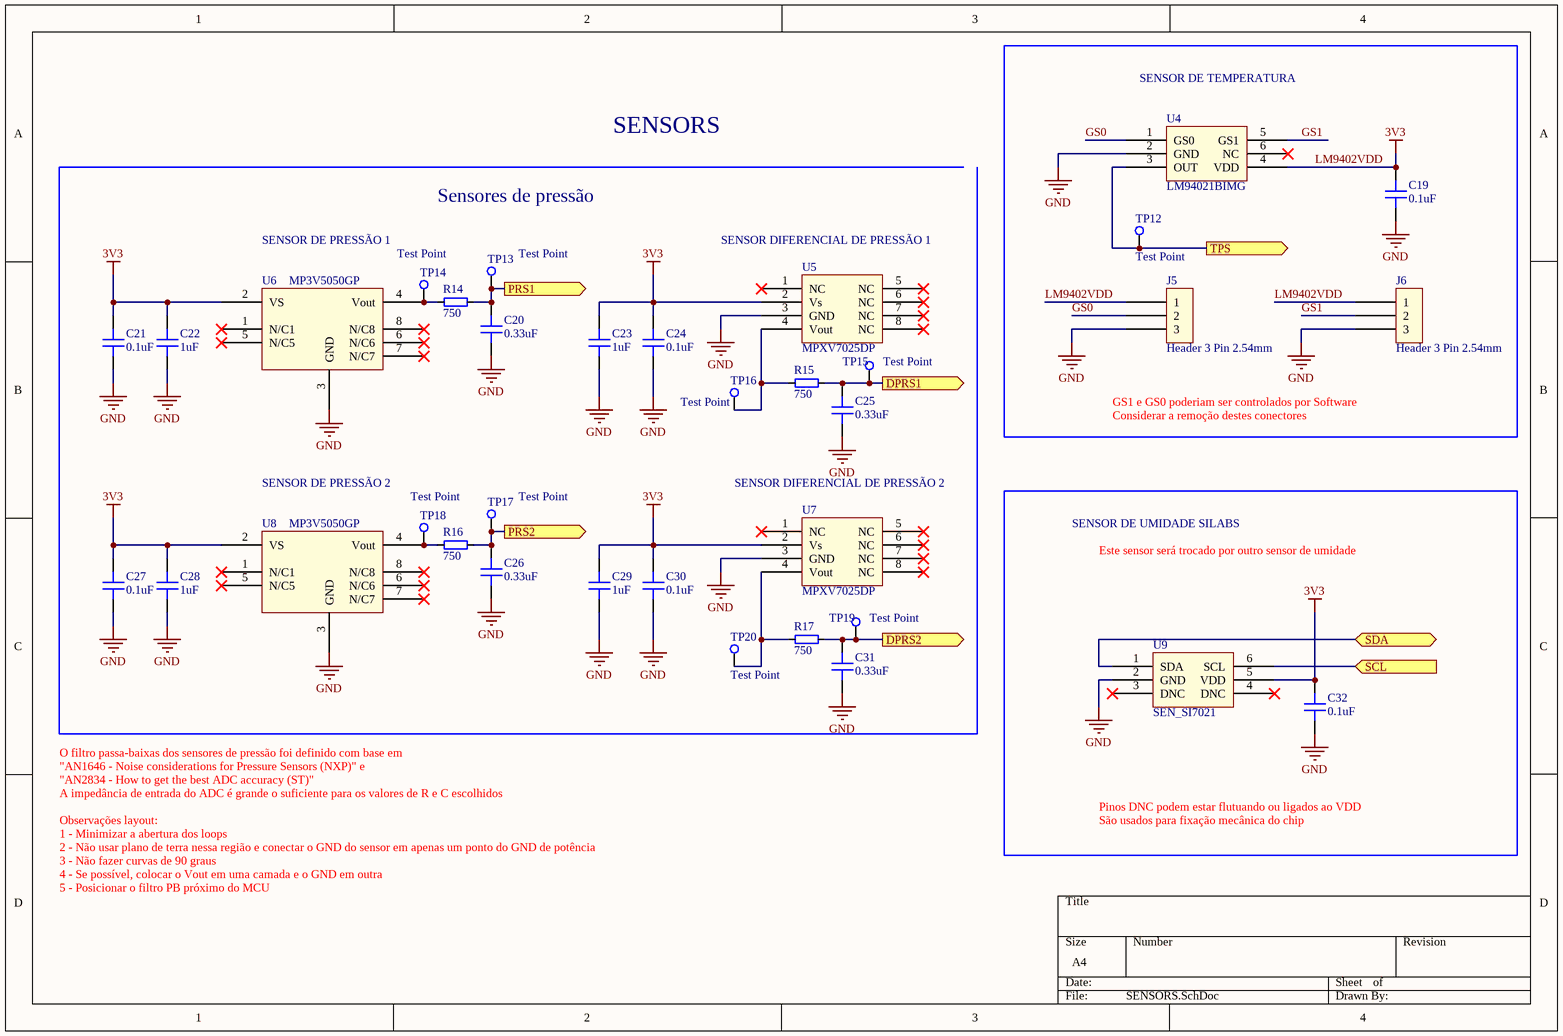
[diagram p4: SENSORS.SchDoc]

### Parts
C19  0.1uF  [C_0805]
C20  0.33uF  [C_0805]
C21  0.1uF  [C_0805]
C22  1uF  [C_0805]
C23  1uF  [C_0805]
C24  0.1uF  [C_0805]
C25  0.33uF  [C_0805]
C26  0.33uF  [C_0805]
C27  0.1uF  [C_0805]
C28  1uF  [C_0805]
C29  1uF  [C_0805]
C30  0.1uF  [C_0805]
C31  0.33uF  [C_0805]
C32  0.1uF  [C_0805]
J5  Header 3 Pin 2.54mm  [Header 3 Pin 2.54mm]
J6  Header 3 Pin 2.54mm  [Header 3 Pin 2.54mm]
R14  750  [R_0805]
R15  750  [R_0805]
R16  750  [R_0805]
R17  750  [R_0805]
TP12  Test Point  [Test_Point]
TP13  Test Point  [Test_Point]
TP14  Test Point  [Test_Point]
TP15  Test Point  [Test_Point]
TP16  Test Point  [Test_Point]
TP17  Test Point  [Test_Point]
TP18  Test Point  [Test_Point]
TP19  Test Point  [Test_Point]
TP20  Test Point  [Test_Point]
U4  LM94021BIMG  [LM94021BIMG]
U5  MPXV7025DP  [MPXV7025DP]
U6  MP3V5050GP  [MP3V5050GP]
U7  MPXV7025DP  [MPXV7025DP]
U8  MP3V5050GP  [MP3V5050GP]
U9  SEN_SI7021  [SI7021_6DFN]

### Ports
DPRS1 (out), DPRS2 (out), PRS1 (out), PRS2 (out), SCL (in), SDA (bidir), TPS (out)

### Nets
GND: C19.1 C20.1 C21.1 C22.1 C23.1 C24.1 C25.1 C26.1 C27.1 C28.1 C29.1 C30.1 C31.1 C32.1 J5.3 J6.3 U4.2(GND) U5.3(GND) U6.3(GND) U7.3(GND) U8.3(GND) U9.2(GND)
LM9402VDD: C19.2 C21.2 C22.2 C23.2 C24.2 C27.2 C28.2 C29.2 C30.2 C32.2 J5.1 J6.1 U4.4(VDD) U5.2(Vs) U6.2(VS) U7.2(Vs) U8.2(VS) U9.5(VDD)  [also labelled 3V3]
GS0: J5.2 U4.1(GS0)
GS1: J6.2 U4.5(GS1)
NetC20_2: C20.2 R14.2 TP13.1(TP) ; port PRS1
NetC25_2: C25.2 R15.2 TP15.1(TP) ; port DPRS1
NetC26_2: C26.2 R16.2 TP17.1(TP) ; port PRS2
NetC31_2: C31.2 R17.2 TP19.1(TP) ; port DPRS2
NetR12_1: U9.1(SDA) ; port SDA
NetR13_1: U9.6(SCL) ; port SCL
NetR14_1: R14.1 TP14.1(TP) U6.4(Vout)
NetR15_1: R15.1 TP16.1(TP) U5.4(Vout)
NetR16_1: R16.1 TP18.1(TP) U8.4(Vout)
NetR17_1: R17.1 TP20.1(TP) U7.4(Vout)
NetTP12_1: TP12.1(TP) U4.3(OUT) ; port TPS

Not connected (* = marked no-connect by the designer): U4 6(NC)*; U5 1(NC)* 5(NC)* 6(NC)* 7(NC)* 8(NC)*; U6 1(N/C1)* 5(N/C5)* 6(N/C6)* 7(N/C7)* 8(N/C8)*; U7 1(NC)* 5(NC)* 6(NC)* 7(NC)* 8(NC)*; U8 1(N/C1)* 5(N/C5)* 6(N/C6)* 7(N/C7)* 8(N/C8)*; U9 3(DNC)* 4(DNC)*

### Notes on the sheet
- SENSOR DE TEMPERATURA
- SENSORS
- SENSOR DE PRESSÃO 1
- Sensores de pressão
- (near U5) SENSOR DIFERENCIAL DE PRESSÃO 1
- GS1 e GS0 poderiam ser controlados por Software
- Considerar a remoção destes conectores
- SENSOR DE PRESSÃO 2
- SENSOR DIFERENCIAL DE PRESSÃO 2
- SENSOR DE UMIDADE SILABS
- Este sensor será trocado por outro sensor de umidade
- O filtro passa-baixas dos sensores de pressão foi definido com base em
- "AN1646 - Noise considerations for Pressure Sensors (NXP)" e
- "AN2834 - How to get the best ADC accuracy (ST)"
- A impedância de entrada do ADC é grande o suficiente para os valores de R e C escolhidos
- Observações layout:
- 1 - Minimizar a abertura dos loops
- 2 - Não usar plano de terra nessa região e conectar o GND do sensor em apenas um ponto do GND de potência
- Pinos DNC podem estar flutuando ou ligados ao VDD
- São usados para fixação mecânica do chip
- 3 - Não fazer curvas de 90 graus
- 4 - Se possível, colocar o Vout em uma camada e o GND em outra
- 5 - Posicionar o filtro PB próximo do MCU

### Library data of the parts
C19 C21 C24 C27 C30 C32 = C_0805_C0805C104K5RAC7411: as C1 on sheet MAIN; Value: 0.1uF; Voltage: 50V; Datasheet: https://www.mouser.in/datasheet/2/212/KEM_C1002_X7R_SMD-1102033.pdf; Supplier: https://www.mouser.in/ProductDetail/KEMET/C0805C104K5RAC7411?qs=sGAEpiMZZMukHu%252BjC5l7YUy%2FB4dg%2FhTABr7B0xlsxU8%3D; Temperature: -55 to +125ºC; Part Number: C0805C104K5RAC7411
C20 C25 C26 C31 = C_0805_C0805C334K5RECTU: SMD/SMT 50V 0.33uF X7R 0805 10%; Manufacturer: KEMET; Value: 0.33uF; Voltage: 50V; Datasheet: https://br.mouser.com/datasheet/2/212/KEM_C1090_X7R_ESD-1103328.pdf; Supplier: https://br.mouser.com/ProductDetail/KEMET/C0805C334K5RECTU?qs=sGAEpiMZZMukHu%252BjC5l7YW4TDpT9cCWZSWBJF89q8JI%3D; Temperature: -55 to +125ºC; Part Number: C0805C334K5RECTU
C22 C23 C28 C29 = C_0805_UMF212B7105KGHT: as C2 on sheet MCU; Value: 1uF; Voltage: 50V; Datasheet: https://www.mouser.in/datasheet/2/396/taiyo_yuden_07182019_MLCC_AECQ200_Grade_1_X7R_data-1622917.pdf; Supplier: https://www.mouser.in/ProductDetail/Taiyo-Yuden/UMF212B7105KGHT?qs=sGAEpiMZZMukHu%252BjC5l7YbZJogKwR3uAsvk8LFV85oI%3D; Temperature: -55 to 125ºC; Part Number: UMF212B7105KGHT
R14-R17 = R_0805_ERJ-ERJ-6GEYJ751V: SMD 0805 750 OHM 5% AEC-Q200; Manufacturer: Panasonic; Voltage: 150V; Value: 750; Supplier: https://br.mouser.com/ProductDetail/Panasonic/ERJ-6GEYJ751V?qs=%2Fha2pyFaduiXHwl36i8QX0hu09VIkjbS%252B7Un%252BBpYHaXMOPUjNj5d7Q%3D%3D; Datasheet: https://br.mouser.com/datasheet/2/315/AOA0000C301-1488782.pdf; Temperature: -55 to +155ºC; Part Number: ERJ-6GEYJ751V
U4 = SEN_LM94021BIMG: IC TEMP SENSOR MULTI-GAIN SC70-5; Part Number: LM94021BIMG; Datasheet: http://www.ti.com/general/docs/suppproductinfo.tsp?distId=26&gotoUrl=http%3A%2F%2Fwww.ti.com%2Flit%2Fgpn%2Flm94021; Supplier: https://br.mouser.com/ProductDetail/Texas-Instruments/LM94021BIMG-NOPB?qs=QbsRYf82W3Gamc2uDn7DIw%3D%3D
U5 U7 = SEN_MPXV7025DP: -25 to 25 kPa Differential Pressure Sensor DUAL PORT 8-SOP; Part Number: MPXV7025DP; Datasheet: https://br.mouser.com/datasheet/2/302/MPXV7025-1127333.pdf; Supplier: https://br.mouser.com/ProductDetail/NXP-Semiconductors/MPXV7025DP?qs=r8OyiFxb6ReyFzMvnwyjmg%3D%3D
U6 U8 = SEN_MP3V5050GP: IC PRESSURE SENSOR 8-SOP 7PSI; Part Number: MP3V5050GP; Datasheet: https://br.mouser.com/datasheet/2/302/MP3V5050-1127012.pdf; Supplier: https://br.mouser.com/ProductDetail/NXP-Semiconductors/MP3V5050GP?qs=H%252BP%2FcHWii3cfygLO%2FUxqlg%3D%3D
U9 = SEN_SI7021: Humidity Sensors Digital RH ( 3% max) & temperature sensor, commercial grade with cover/filter; Supplier: https://br.mouser.com/ProductDetail/Silicon-Labs/SI7021-A20-GM1R?qs=sGAEpiMZZMsB9HsreUc%252BiUv%2FuYCFaXZo1mgPtJm187g%3D; Datasheet: https://br.mouser.com/datasheet/2/368/Si7021-A20-1397917.pdf
J5 J6 = Header 3 Pin 2.54mm: Datasheet: https://br.mouser.com/datasheet/2/276/0022285033_PCB_HEADERS-159031.pdf; Supplier: https://br.mouser.com/ProductDetail/Molex/22-28-5033?qs=sGAEpiMZZMs%252BGHln7q6pmxD%2F5kNJnZVepHUluVJbZ54%3D

## Nets that join several sheets
5V: POWER (5 pins), MAIN (LED1.1 LED1.3 LED1.5), SWITCHING (12 pins)
GND: POWER (12 pins), MAIN (18 pins), MCU (15 pins), SWITCHING (5 pins), SENSORS (22 pins)
LM9402VDD: POWER (C17.1 C18.2 TP8.1 U3.2), MAIN (LS1.1 R2.2), MCU (L4.1), SENSORS (18 pins)
MCU3V3: MAIN (10 pins), MCU (19 pins)
VBAT: POWER (D1.1 J4.1 TP6.1), MCU (U1.1)
BOOT: MAIN (R1.2), MCU (U1.44)
BUTTON1: MAIN (BT2.1 BT2.2), MCU (U1.29)
BUTTON2: MAIN (BT1.1 BT1.2), MCU (U1.28)
BUTTON3: MAIN (BT5.1 BT5.2), MCU (U1.27)
BUTTON4: MAIN (BT4.1 BT4.2), MCU (U1.26)
BUZZER: MAIN (Q1.1 R3.2), MCU (U1.43)
EXT_SCL: MAIN (J1.10), MCU (R10.1 U1.45)
EXT_SDA: MAIN (J1.9), MCU (R11.1 U1.46)
LED_B: MAIN (Q2.1 R7.2), MCU (U1.4)
LED_G: MAIN (Q3.1 R8.2), MCU (U1.3)
LED_R: MAIN (Q4.1 R9.2), MCU (U1.2)
NetC20_2: MCU (U1.18), SENSORS (C20.2 R14.2 TP13.1)
NetC25_2: MCU (U1.20), SENSORS (C25.2 R15.2 TP15.1)
NetC26_2: MCU (U1.19), SENSORS (C26.2 R16.2 TP17.1)
NetC31_2: MCU (U1.21), SENSORS (C31.2 R17.2 TP19.1)
NetR12_1: MCU (R12.1 U1.36), SENSORS (U9.1)
NetR13_1: MCU (R13.1 U1.35), SENSORS (U9.6)
NetR18_1: MCU (U1.42), SWITCHING (R18.1)
NetR21_1: MCU (U1.38), SWITCHING (R21.1)
NetR22_1: MCU (U1.39), SWITCHING (R22.1)
NetR25_1: MCU (U1.40), SWITCHING (R25.1)
NetR26_1: MCU (U1.41), SWITCHING (R26.1)
NetTP12_1: MCU (U1.22), SENSORS (TP12.1 U4.3)
PA4_IO: MAIN (J2.7), MCU (U1.14)
PA5_IO: MAIN (J2.8), MCU (U1.15)
PA6_IO: MAIN (J2.9), MCU (U1.16)
RST: MAIN (BT3.1 BT3.2 C1.2 J1.2), MCU (U1.7)
SPI3_CS: MAIN (J2.3), MCU (U1.10)
SPI3_MISO: MAIN (J2.4), MCU (U1.12)
SPI3_MOSI: MAIN (J2.6), MCU (U1.13)
SWCLK: MAIN (J1.6), MCU (U1.37)
SWDIO: MAIN (J1.8), MCU (U1.34)
USART1_RX: MAIN (J1.5), MCU (U1.31)
USART1_TX: MAIN (J1.7), MCU (U1.30)
USB_DM: MAIN (J3.2), MCU (U1.32)
USB_DP: MAIN (J3.3), MCU (U1.33)